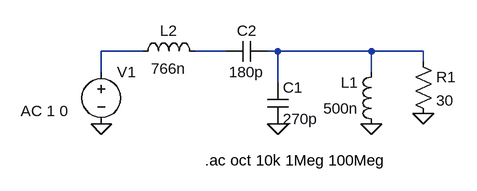
[diagram p0: schematic filter.asc]
filter.asc, the LTspice schematic file:
Version 4
SHEET 1 880 680
WIRE 32 112 -32 112
WIRE 160 112 112 112
WIRE 240 112 224 112
WIRE 384 112 240 112
WIRE 464 112 384 112
WIRE 464 128 464 112
WIRE -32 144 -32 112
WIRE 384 144 384 112
WIRE 240 160 240 112
FLAG 240 224 0
FLAG 384 224 0
FLAG -32 224 0
FLAG 464 208 0
SYMBOL voltage -32 128 R0
WINDOW 3 -128 132 Left 2
WINDOW 123 -124 76 Left 2
WINDOW 39 0 0 Left 0
SYMATTR Value ""
SYMATTR Value2 AC 1 0
SYMATTR InstName V1
SYMBOL ind 400 240 R180
WINDOW 0 36 80 Left 2
WINDOW 3 36 40 Left 2
SYMATTR InstName L1
SYMATTR Value 500n
SYMATTR SpiceLine Rser=.75
SYMBOL cap 224 160 R0
SYMATTR InstName C1
SYMATTR Value 270p
SYMATTR SpiceLine Rser=3
SYMBOL cap 224 96 R90
WINDOW 0 0 32 VBottom 2
WINDOW 3 32 32 VTop 2
SYMATTR InstName C2
SYMATTR Value 180p
SYMATTR SpiceLine Rser=3
SYMBOL ind 16 128 R270
WINDOW 0 32 56 VTop 2
WINDOW 3 5 56 VBottom 2
SYMATTR InstName L2
SYMATTR Value 766n
SYMATTR SpiceLine Rser=.75
SYMBOL res 448 112 R0
SYMATTR InstName R1
SYMATTR Value 30
TEXT 128 280 Left 2 !.ac oct 10k 1Meg 100Meg

The netlist it stands for:
* filter.asc
V1 N001 0 AC 1 0
L1 0 N003 500n Rser=.75
C1 N003 0 270p Rser=3
C2 N003 N002 180p Rser=3
L2 N001 N002 766n Rser=.75
R1 N003 0 30
.ac oct 10k 1Meg 100Meg
.backanno
.end